# Altium schematic sheet 双电机电机模块.SchDoc
size A3
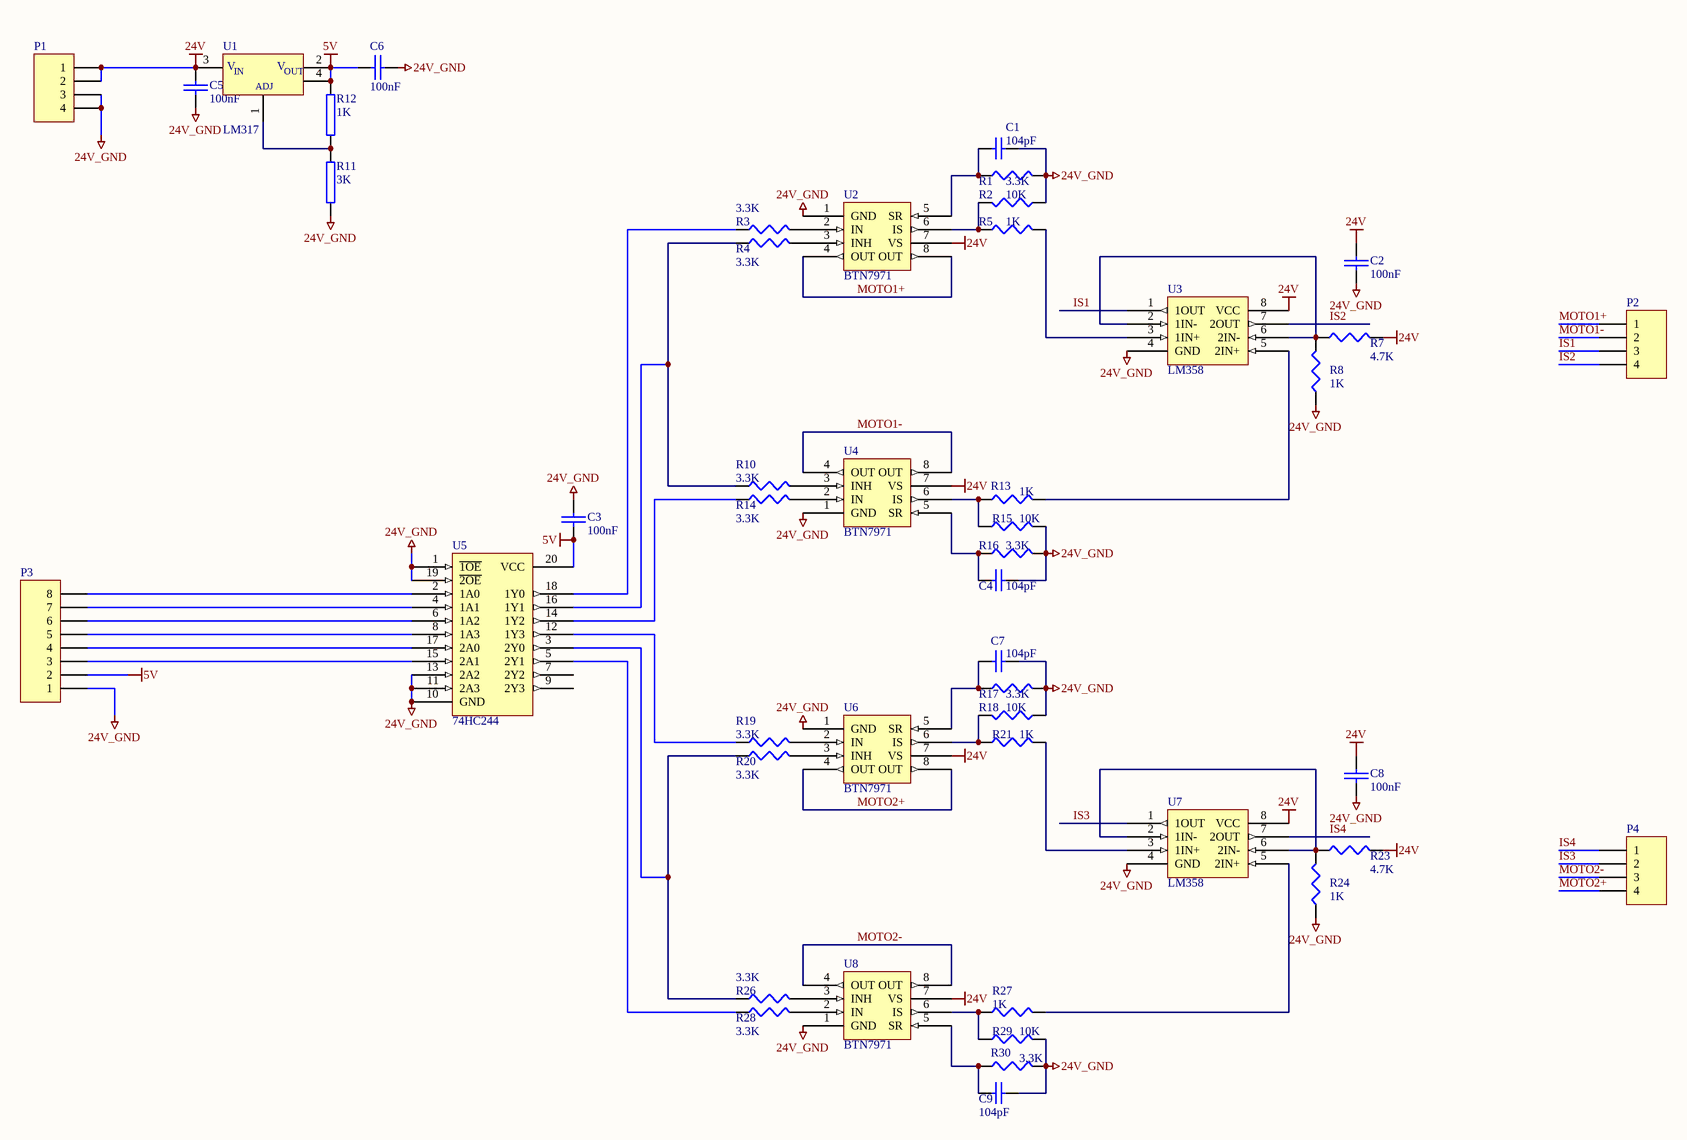
[diagram p0: 双电机电机模块.SchDoc]

## Parts
C1  value 104pF  [0603c]  (hidden comment: Cap Semi)
C2  100nF  [0603C]
C3  100nF  [0603C]
C4  value 104pF  [0603c]  (hidden comment: Cap Semi)
C5  100nF  [0603C]
C6  100nF  [0603C]
C7  value 104pF  [0603c]  (hidden comment: Cap Semi)
C8  100nF  [0603C]
C9  value 104pF  [0603c]  (hidden comment: Cap Semi)
P1  (no value)  [4ELPV-3.96]
P2  (no value)  [4ELPV-3.96]
P3  (no value)  [HDR1X8]
P4  (no value)  [4ELPV-3.96]
R1  value 3.3K  [0603R]  (hidden comment: Res3)
R2  value 10K  [0603R]  (hidden comment: Res3)
R3  value 3.3K  [0603R]  (hidden comment: Res3)
R4  value 3.3K  [0603R]  (hidden comment: Res3)
R5  value 1K  [0603R]  (hidden comment: Res3)
R7  value 4.7K  [0603R]  (hidden comment: Res3)
R8  value 1K  [0603R]  (hidden comment: Res3)
R10  value 3.3K  [0603R]  (hidden comment: Res3)
R11  3K  [0603R]
R12  1K  [0603R]
R13  value 1K  [0603R]  (hidden comment: Res3)
R14  value 3.3K  [0603R]  (hidden comment: Res3)
R15  value 10K  [0603R]  (hidden comment: Res3)
R16  value 3.3K  [0603R]  (hidden comment: Res3)
R17  value 3.3K  [0603R]  (hidden comment: Res3)
R18  value 10K  [0603R]  (hidden comment: Res3)
R19  value 3.3K  [0603R]  (hidden comment: Res3)
R20  value 3.3K  [0603R]  (hidden comment: Res3)
R21  value 1K  [0603R]  (hidden comment: Res3)
R23  value 4.7K  [0603R]  (hidden comment: Res3)
R24  value 1K  [0603R]  (hidden comment: Res3)
R26  value 3.3K  [0603R]  (hidden comment: Res3)
R27  value 1K  [0603R]  (hidden comment: Res3)
R28  value 3.3K  [0603R]  (hidden comment: Res3)
R29  value 10K  [0603R]  (hidden comment: Res3)
R30  value 3.3K  [0603R]  (hidden comment: Res3)
U1  LM317  [sot223]
U2  BTN7971  [TO263-7-1]
U3  LM358  [SO-8]
U4  BTN7971  [TO263-7-1]
U5  74HC244  [SOIC20]
U6  BTN7971  [TO263-7-1]
U7  LM358  [SO-8]
U8  BTN7971  [TO263-7-1]

## Nets
5V: C3.1 C6.2 P3.2 R12.1 U1.2(VOUT) U1.4(VOUT) U5.20(VCC)
24V: C2.2 C5.1 C8.2 P1.1 P1.2 R7.2 R23.2 U1.3(VIN) U2.7(VS) U3.8(VCC) U4.7(VS) U6.7(VS) U7.8(VCC) U8.7(VS)
24V_GND: C1.2 C2.1 C3.2 C4.2 C5.2 C6.1 C7.2 C8.1 C9.2 P1.3 P1.4 P3.1 R1.2 R2.1 R8.1 R11.1 R15.2 R16.2 R17.2 R18.1 R24.1 R29.2 R30.2 U2.1(GND) U3.4(GND) U4.1(GND) U5.1(~{1OE}) U5.10(GND) U5.11(2A3) U5.13(2A2) U5.19(~{2OE}) U6.1(GND) U7.4(GND) U8.1(GND)
IS1: P2.3 U3.1(1OUT)
IS2: P2.4 U3.7(2OUT)
IS3: P4.2 U7.1(1OUT)
IS4: P4.1 U7.7(2OUT)
MOTO1+: P2.1 U2.4(OUT) U2.8(OUT)
MOTO1-: P2.2 U4.4(OUT) U4.8(OUT)
MOTO2+: P4.4 U6.4(OUT) U6.8(OUT)
MOTO2-: P4.3 U8.4(OUT) U8.8(OUT)
NetC1_1: C1.1 R1.1 U2.5(SR)
NetC4_1: C4.1 R16.1 U4.5(SR)
NetC7_1: C7.1 R17.1 U6.5(SR)
NetC9_1: C9.1 R30.1 U8.5(SR)
NetP3_3: P3.3 U5.15(2A1)
NetP3_4: P3.4 U5.17(2A0)
NetP3_5: P3.5 U5.8(1A3)
NetP3_6: P3.6 U5.6(1A2)
NetP3_7: P3.7 U5.4(1A1)
NetP3_8: P3.8 U5.2(1A0)
NetR2_2: R2.2 R5.1 U2.6(IS)
NetR3_1: R3.1 U5.18(1Y0)
NetR3_2: R3.2 U2.2(IN)
NetR4_1: R4.1 R10.1 U5.16(1Y1)
NetR4_2: R4.2 U2.3(INH)
NetR5_2: R5.2 U3.3(1IN+)
NetR7_1: R7.1 R8.2 U3.2(1IN-) U3.6(2IN-)
NetR10_2: R10.2 U4.3(INH)
NetR11_2: R11.2 R12.2 U1.1(ADJ)
NetR13_1: R13.1 R15.1 U4.6(IS)
NetR13_2: R13.2 U3.5(2IN+)
NetR14_1: R14.1 U5.14(1Y2)
NetR14_2: R14.2 U4.2(IN)
NetR18_2: R18.2 R21.1 U6.6(IS)
NetR19_1: R19.1 U5.12(1Y3)
NetR19_2: R19.2 U6.2(IN)
NetR20_1: R20.1 R26.1 U5.3(2Y0)
NetR20_2: R20.2 U6.3(INH)
NetR21_2: R21.2 U7.3(1IN+)
NetR23_1: R23.1 R24.2 U7.2(1IN-) U7.6(2IN-)
NetR26_2: R26.2 U8.3(INH)
NetR27_1: R27.1 R29.1 U8.6(IS)
NetR27_2: R27.2 U7.5(2IN+)
NetR28_1: R28.1 U5.5(2Y1)
NetR28_2: R28.2 U8.2(IN)

Not connected (* = marked no-connect by the designer): U5 7(2Y2) 9(2Y3)

## Notes on the sheet
- (in symbol LM317) V; IN; OUT

## Library data of the parts
C1 C4 C7 C9 = Cap Semi: Capacitor (Semiconductor SIM Model); Published: 8-Jun-2000; LatestRevisionDate: 17-Jul-2002; LatestRevisionNote: Re-released for DXP Platform.; PackageReference: C1206; Publisher: Altium Limited
C2 C3 C5 C6 C8 = CAP
P1 P2 P4 = Header 4: Header, 4-Pin; LatestRevisionDate: 17-Jul-2002; LatestRevisionNote: Re-released for DXP Platform.; Publisher: Altium Limited
P3 = Header 8: Header, 8-Pin; LatestRevisionDate: 17-Jul-2002; LatestRevisionNote: Re-released for DXP Platform.; Publisher: Altium Limited
R1-R5 R7 R8 R10 R13-R21 R23 R24 R26-R30 = Res3: Resistor; Published: 8-Jun-2000; LatestRevisionDate: 04-Mar-2005; LatestRevisionNote: PCB Footprint replaced.; PackageReference: J1-0603; Publisher: Altium Limited
R11 R12 = RES2
U1 = LM317: 3-Terminal Adjustable Positive Voltage Regulator